# Altium schematic sheet acelerometro.SchDoc
size A; SheetNumber: 1; SheetTotal: 1
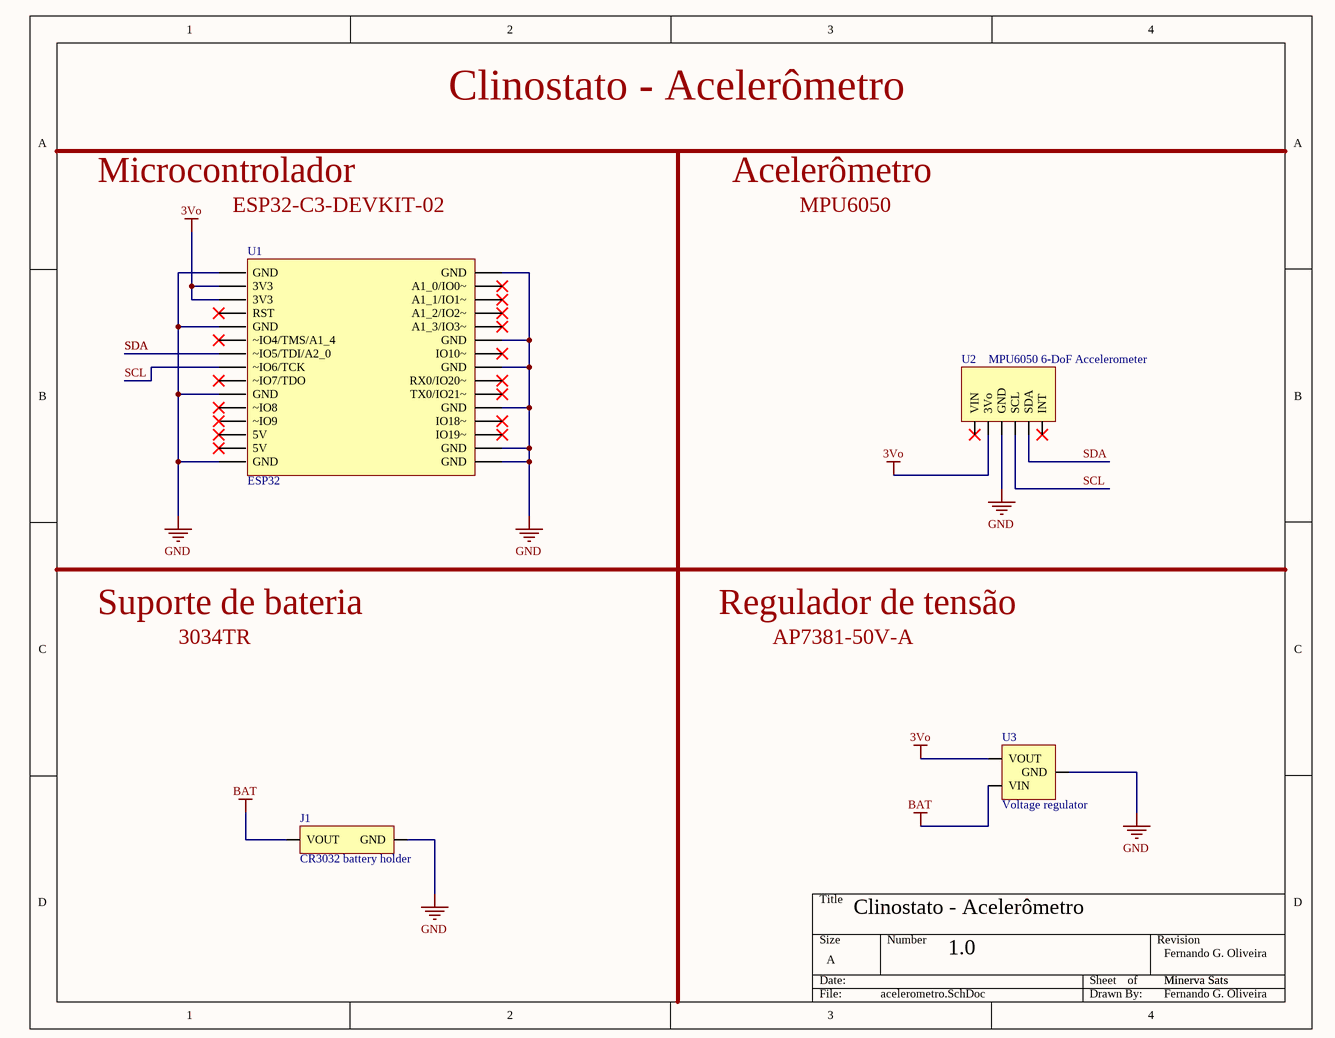
[diagram p0: acelerometro.SchDoc, right]

## Parts
J1  CR3032 battery holder  [FP-3034TR-MFG]
U1  ESP32  [FP-ESP32-C3-DevKitC-02-MFG]
U2  MPU6050 6-DoF Accelerometer  [MPU6050]
U3  Voltage regulator  [AP7381-50V-A]

## Nets
3Vo: U1.2(3V3) U1.3(3V3) U2.2(3Vo) U3.1(VOUT)
BAT: J1.1(VOUT) U3.3(VIN)
GND: J1.2(GND) U1.1(GND) U1.5(GND) U1.10(GND) U1.15(GND) U1.16(GND) U1.17(GND) U1.20(GND) U1.23(GND) U1.25(GND) U1.30(GND) U2.3(GND) U3.2(GND)
SCL: U1.8(~IO6/TCK) U2.4(SCL)
SDA: U1.7(~IO5/TDI/A2_0) U2.5(SDA)

Not connected (* = marked no-connect by the designer): U1 4(RST)* 6(~IO4/TMS/A1_4)* 9(~IO7/TDO)* 11(~IO8)* 12(~IO9)* 13(5V)* 14(5V)* 18(IO19~)* 19(IO18~)* 21(TX0/IO21~)* 22(RX0/IO20~)* 24(IO10~)* 26(A1_3/IO3~)* 27(A1_2/IO2~)* 28(A1_1/IO1~)* 29(A1_0/IO0~)*; U2 1(VIN)* 6(INT)*

## Notes on the sheet
- Clinostato - Acelerômetro
- Microcontrolador
- ESP32-C3-DEVKIT-02
- Acelerômetro
- MPU6050
- Suporte de bateria
- 3034TR
- Regulador de tensão
- AP7381-50V-A
- 1.0
- Fernando G. Oliveira
- Minerva Sats

## Library data of the parts
J1 = 3034TR
U1 = ESP32-C3-DEVKITC-02: Manufacturer: Espressif Systems; Supplier: Digikey; Supplier Part Number: 1965-ESP32-C3-DEVKITC-02-ND; Manufacturer Part Number: ESP32-C3-DEVKITC-02; RoHS: No; Category: RF Semiconductors and Devices; Stock: 1074; Pricing: 1=8 (USD)
U2 = 3886: Apex Tool Group Ratcheting Tap and Die Set (40-Piece) 3886; Manufacturer: Adafruit Industries; Supplier: Digikey; Supplier Part Number: 1528-3886-ND; Manufacturer Part Number: 3886; RoHS: No; Category: Uncategorized; Stock: 118; Pricing: 1=12.95 (USD)
U3 = AP7381-50V-A: Fixed Positive LDO Regulator; Manufacturer: Diodes; Regulator Type: FIXED POSITIVE SINGLE OUTPUT LDO REGULATOR; Time @ Peak Reflow Temperature-Max (s): 30s; Supplier: Digikey; Supplier Part Number: AP7381-50V-ADICT-ND; Manufacturer Part Number: AP7381-50V-A; RoHS: Yes; Stock: 6439; Pricing: 1=0.46, 10=0.374, 25=0.3424, 100=0.2547, 250=0.2308, 500=0.19102, 1000=0.14326 (USD); Peak Reflow Temperature (Cel): 260°C; Reach SVHC Compliant: Yes; RoHS Compliant: Yes; ComponentLink1URL: https://datasheet.ciiva.com:443/pdfs/VipMasterIC/IC/DIOD/DIOD-S-A0009691348/DIOD-S-A0009865550-1.pdf?src-supplier=IHS+Markit; ComponentLink1Description: https://datasheet.ciiva.com:443/pdfs/VipMasterIC/IC/DIOD/DIOD-S-A0009691348/DIOD-S-A0009865550-1.pdf?src-supplier=IHS+Markit; ComponentLink2URL: https://www.diodes.com/assets/Datasheets/AP7381.pdf?src-supplier=Digikey; ComponentLink2Description: https://www.diodes.com/assets/Datasheets/AP7381.pdf?src-supplier=Digikey